# EAGLE design ShieldThunder (EAGLE 9.4.2)
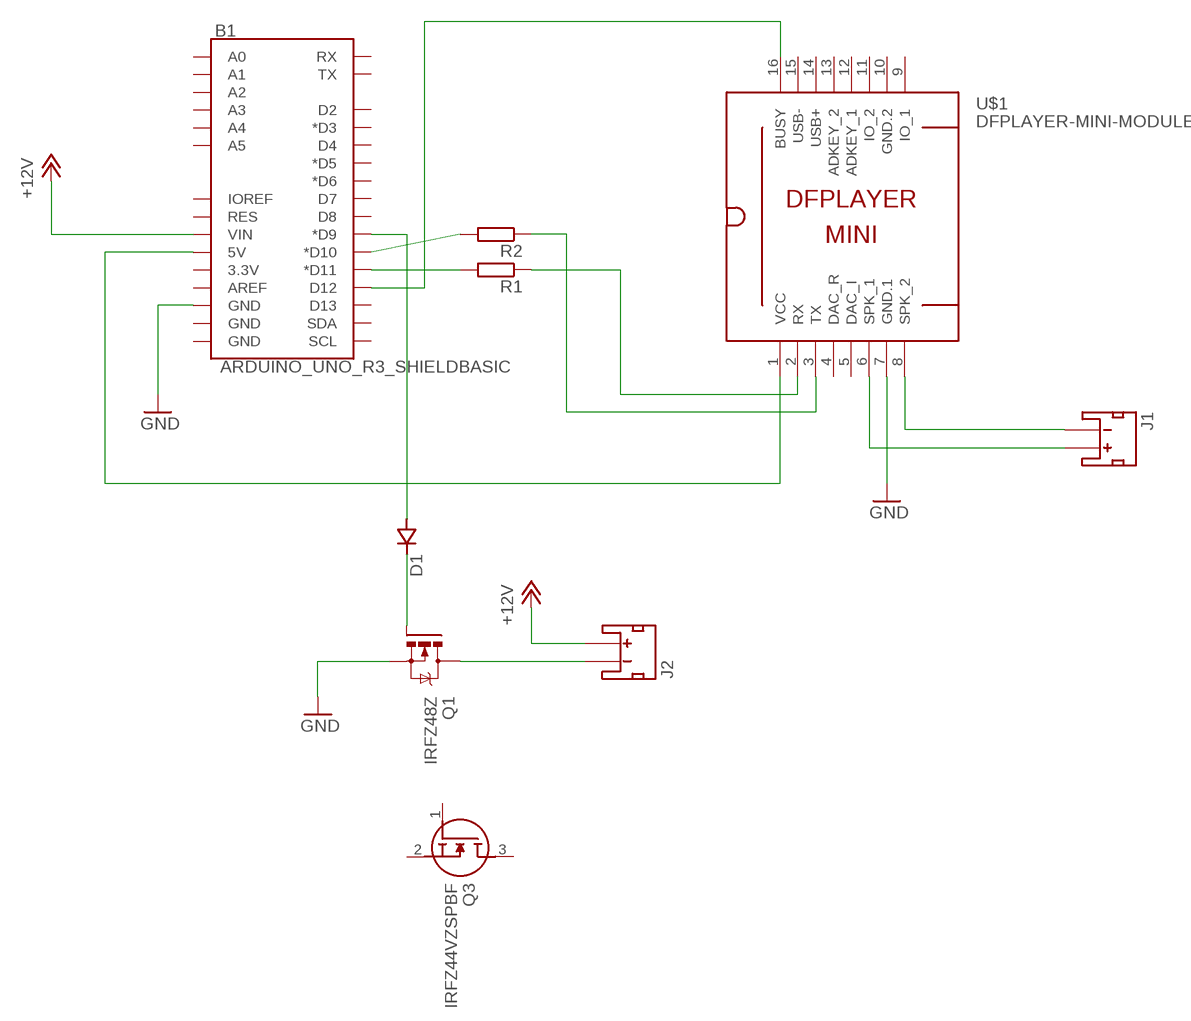
[diagram p0: schematic, sheet 1]

## Parts
B1  ARDUINO_UNO_R3_SHIELDBASIC  [UNO_R3_SHIELD]
D1  DSOT23  [SOT-23]
J1  JST_2MM_MALE  [JST-2-SMD]
J2  JST_2MM_MALE  [JST-2-SMD]
Q1  IRFZ48Z  [TO220BH]
Q3  IRFZ44VZSPBF  [D2PAK(TO-263AB)]
R1  R-EU_R0805  [R0805]
R2  R-EU_R0805  [R0805]
U$1  DFPLAYER-MINI-MODULE  [DFPLAYER-MINI-MODULE]

## Nets
+12V: B1.VIN J2.2(+)
GND: B1.GND@2(GND) Q1.S U$1.7(GND.1)
N$1: B1.D10(*D10) R2.2
N$2: B1.D11(*D11) R1.2
N$3: R1.1 U$1.2(RX)
N$4: R2.1 U$1.3(TX)
N$5: B1.D12 U$1.16(BUSY)
N$6: J1.2(+) U$1.6(SPK_1)
N$7: J1.1(-) U$1.8(SPK_2)
N$8: B1.D9(*D9) D1.3(A)
N$9: D1.1(C) Q1.G
N$10: J2.1(-) Q1.D
N$11: B1.5V U$1.1(VCC)
Unconnected: B1.3.3V B1.A0 B1.A1 B1.A2 B1.A3 B1.A4 B1.A5 B1.AREF B1.D2 B1.D3(*D3) B1.D4 B1.D5(*D5) B1.D6(*D6) B1.D7 B1.D8 B1.D13 B1.GND@0(GND) B1.GND@1(GND) B1.IOREF B1.RES B1.RX B1.SCL B1.SDA B1.TX J1.NC1(PAD1) J1.NC2(PAD2) J2.NC1(PAD1) J2.NC2(PAD2) Q3.1(G) Q3.2(S) Q3.3(D) U$1.4(DAC_R) U$1.5(DAC_I) U$1.9(IO_1) U$1.11(IO_2) U$1.12(ADKEY_1) U$1.13(ADKEY_2) U$1.14(USB+) U$1.15(USB-)

## Power pins joined to a net without a drawn wire
GND.2: U$1.10(GND.2)

## Library data of the parts
B1 = SparkFun-Boards:ARDUINO_UNO_R3_SHIELD: Arduino R3 Shield Footprint Shield form compatible with the Arduino Uno R3. SparkFun Products: MG2639 Cellular Shield <https://www.sparkfun.com/products/13120> MIDI Shield <https://www.sparkfun.com/products/12898> R3 Stackable Headers Kit <https://www.sparkfun.com/products/11417>
D1 = zetex:D: DIODE; MPN: CDSOT23-T03; OC_FARNELL: 1824866; OC_NEWARK: 75K7096
J1 J2 = SparkFun-Connectors:JST_2MM_MALE: JST 2MM MALE RA CONNECTOR Two pin, compact surface mount connector. Commonly used as a battery input connection point. We really like the solid locking feeling and high current rating on these small connectors. We use these all the time as battery connectors. Mates to single-cell LiPo batteries. Here is the connector we sell at SparkFun: JST Right Angle Connector - White <https://www.sparkfun.com/products/8612> (PRT-08612) Datasheet <http://www.sparkfun.com/datasheets/Prototyping/Connectors/JST-Horizontal.pdf> It was used on these SparkFun products: SparkFun MOSFET Power Controller <https://www.sparkfun.com/products/11214> (PRT-11214) SparkFun Battery Babysitter - LiPo Battery Manager <https://www.sparkfun.com/products/13777> (PRT-13777) And many, many others that required a lipo battery connection.; PROD_ID: CONN-11443; SF_ID: PRT-08612
Q1 = transistor-power:IRFZ48: N Channel HEXFET® Power MOSFET Logic Level Source: http://www.irf.com/product-info/datasheets/data/irfz48z.pdf
Q3 = SamacSys_Parts:IRFZ44VZSPBF: Infineon IRFZ44VZSPBF N-channel MOSFET, 57 A, 60 V HEXFET, 3-Pin D2PAK Source: Datasheet <https://componentsearchengine.com/Datasheets/1/IRFZ44VZSPBF.pdf>; DESCRIPTION: Infineon IRFZ44VZSPBF N-channel MOSFET, 57 A, 60 V HEXFET, 3-Pin D2PAK; HEIGHT: mm; MANUFACTURER_NAME: Infineon; MANUFACTURER_PART_NUMBER: IRFZ44VZSPBF; MOUSER_PART_NUMBER: 942-IRFZ44VZSPBF; MOUSER_PRICE-STOCK: https://www.mouser.com/Search/Refine.aspx?Keyword=942-IRFZ44VZSPBF
R1 R2 = rcl:R-EU_: RESISTOR, European symbol; SPICEPREFIX: 1K
U$1 = diy-modules:DFPLAYER-MINI-MODULE: DFPlayer Mini - MP3 player module based on YX5200 chip More details available here: https://www.dfrobot.com/wiki/index.php/DFPlayer_Mini_SKU:DFR0299 Click here to find device on ebay.com <http://www.ebay.com/sch/dfplayer+mini>

## Net classes
0 default: width 0.254 mm

## Board
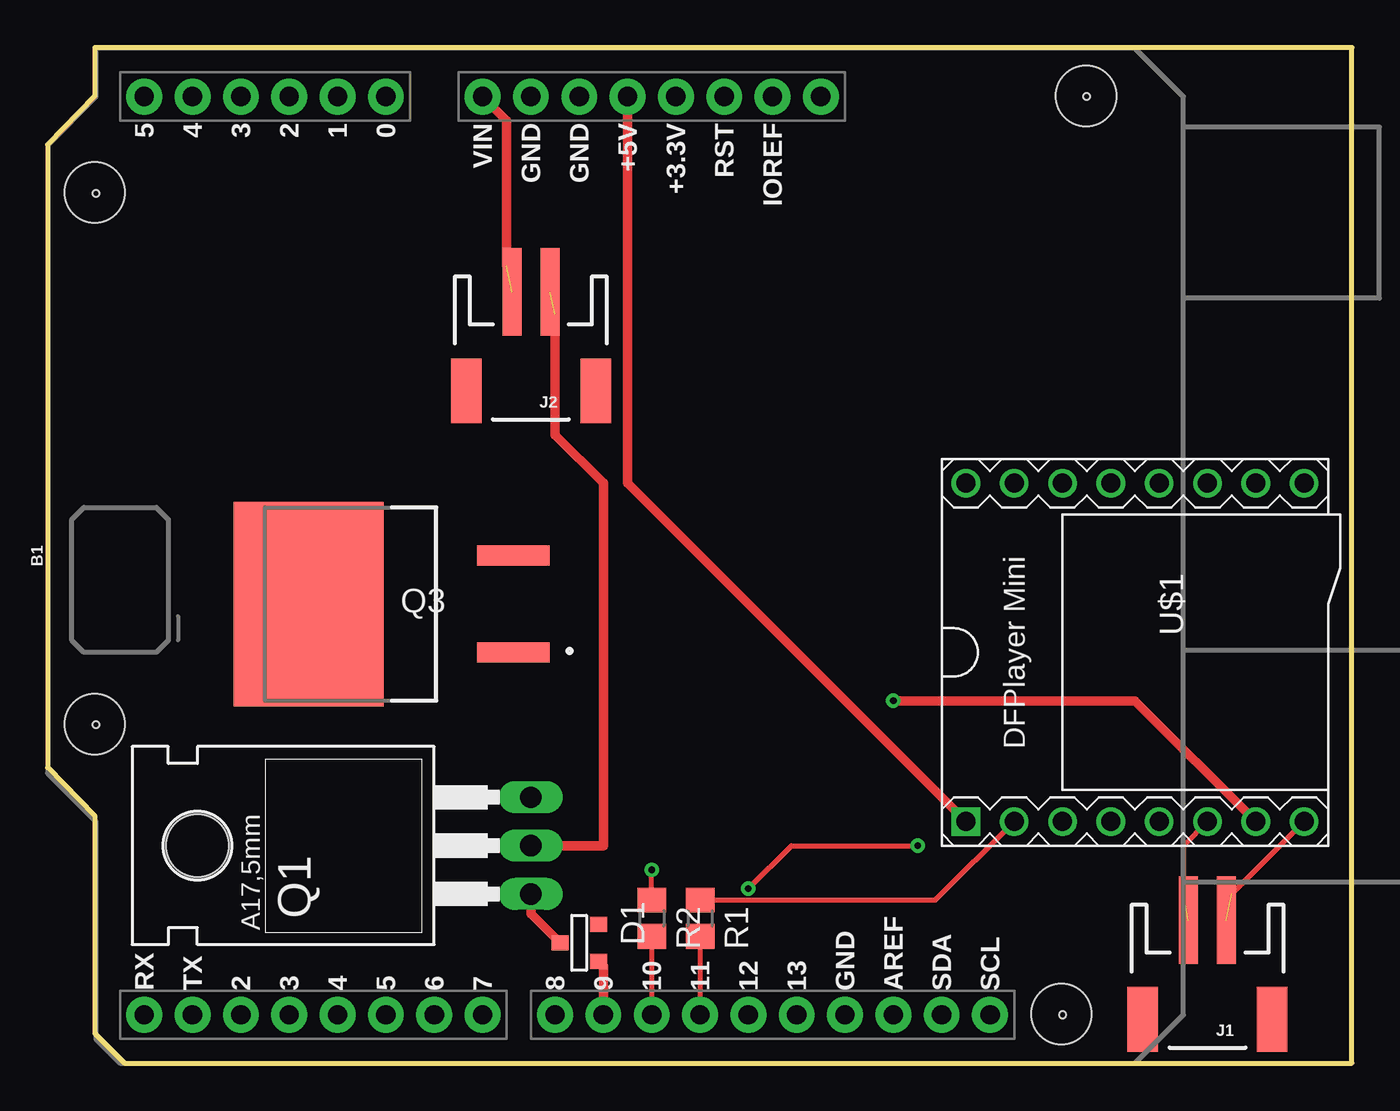
[diagram p1: board, top side]
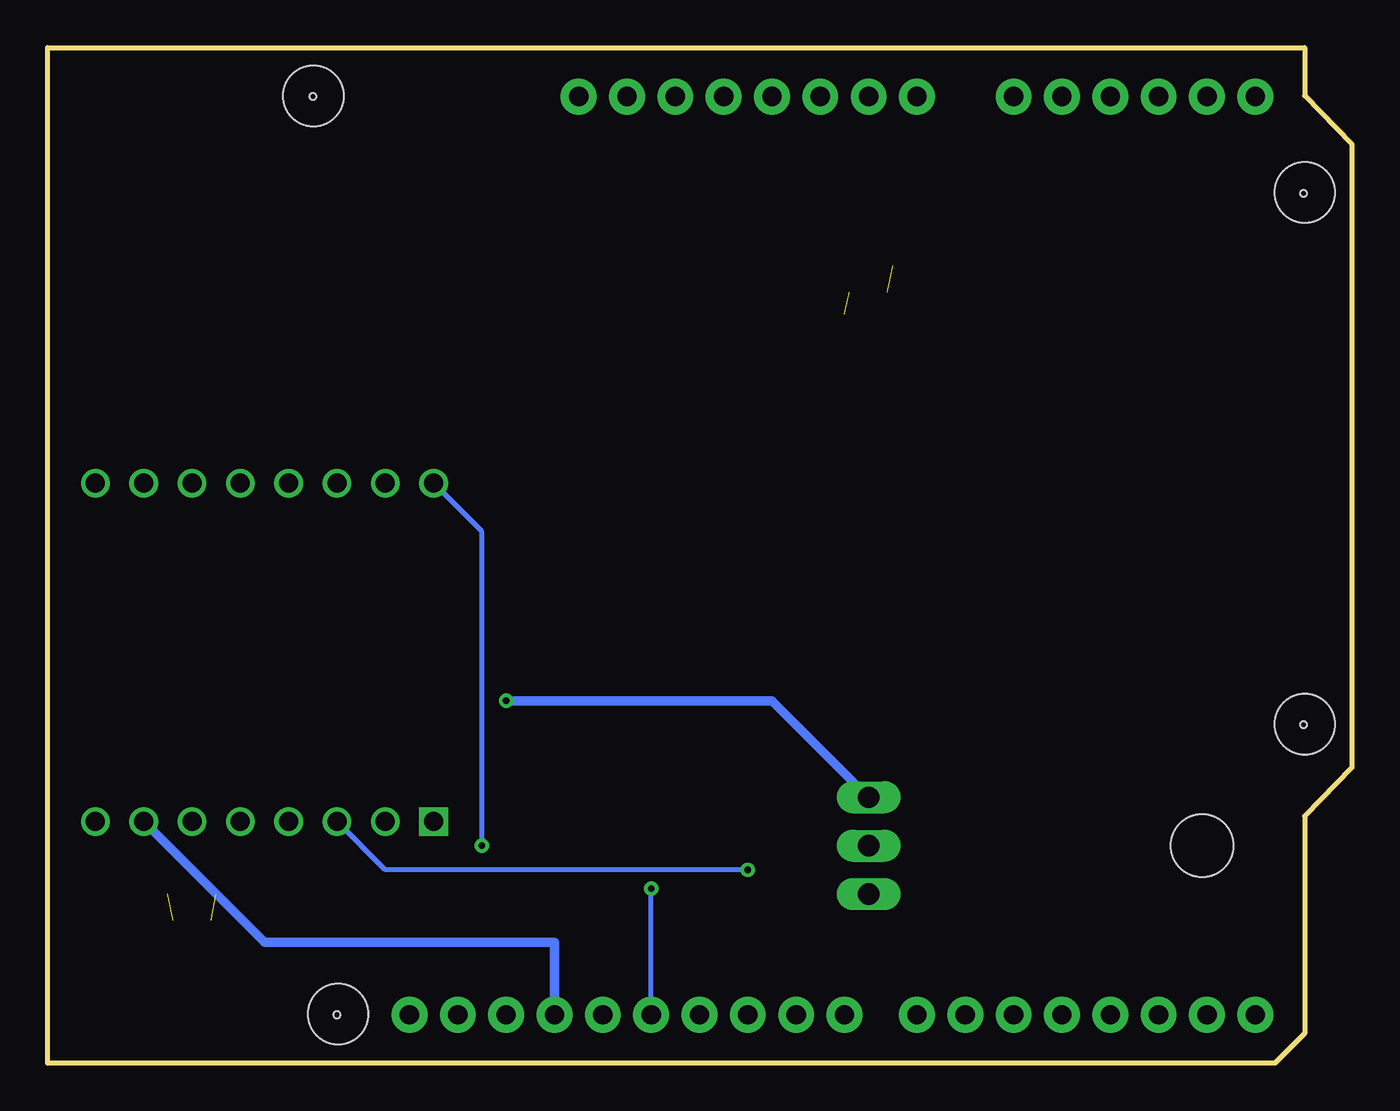
[diagram p2: board, bottom side, seen from below]

Size 68.55 x 53.38 mm. Coordinates in mm from the lower left corner, seen from the top.
Outline: 68.55,0 68.55,53.38 2.48,53.38 2.48,50.84 0,48.3 0,15.53 2.48,12.99 2.48,1.56 4.04,0 68.55,0
Copper layers (1*16): Top 0.035mm / dielectric 1.5mm / Bottom 0.035mm
Design rules "default": minimum track width 6mil, minimum drill 0.35mm, track to track 6mil, track to pad 6mil, pad to pad 6mil, via to via 6mil, smd to smd 6mil, copper to edge 40mil, drill to drill 6mil, minimum pad ring 10mil, minimum via ring 8mil, stop-mask expansion 4mil, vias tented up to drill 0mil, thermal gap 10mil
Holes 3.17 mm at 2.48,45.76 53.28,2.58 2.48,17.82 54.58,50.84
Holes 0.35 mm at 54.61,50.8 2.54,45.72 2.54,17.78 53.34,2.54

### Footprints (pad centres in the part's own frame; a part is rotated, then mirrored left to right if it is on the bottom)
UNO_R3_SHIELD = drill 1.016 pad 1.88: 3.3V 24.13,-2.54; 5V 24.13,0; A0 24.13,12.7; A1 24.13,15.24; A2 24.13,17.78; A3 24.13,20.32; A4 24.13,22.86; A5 24.13,25.4; AREF -24.13,-13.97; D2 -24.13,20.32; D3 -24.13,17.78; D4 -24.13,15.24; D5 -24.13,12.7; D6 -24.13,10.16; D7 -24.13,7.62; D8 -24.13,3.81; D9 -24.13,1.27; D10 -24.13,-1.27; D11 -24.13,-3.81; D12 -24.13,-6.35; D13 -24.13,-8.89; GND@0 24.13,2.54; GND@1 24.13,5.08; GND@2 -24.13,-11.43; IOREF 24.13,-7.62; NC 24.13,-10.16; RES 24.13,-5.08; RX -24.13,25.4; SCL -24.13,-19.05; SDA -24.13,-16.51; TX -24.13,22.86; VIN 24.13,7.62
SOT-23 = smd 0.787 x 0.889: 1 0.025,-1.016; 2 -0.94,1.016; 3 0.991,1.016
JST-2-SMD = smd 1 x 4.6: 1 -1,-3.7; 2 1,-3.7 | smd 1.6 x 3.4: NC1 -3.4,1.5; NC2 3.4,1.5
TO220BH = drill 1.118 long: D 0,-6.35; G -2.54,-6.35; S 2.54,-6.35 | hole 3.302: 0,11.176
D2PAK(TO-263AB) = smd 3.8 x 1.05: 1 -13.043,2.54; 2 -13.043,-2.54 | smd 7.9 x 10.75: 3 -2.293,0
R0805 = smd 1.3 x 1.5: 1 -0.95,0; 2 0.95,0
DFPLAYER-MINI-MODULE = drill 1 square: 1 -8.89,-8.89 | drill 1: 2 -6.35,-8.89; 3 -3.81,-8.89; 4 -1.27,-8.89; 5 1.27,-8.89; 6 3.81,-8.89; 7 6.35,-8.89; 8 8.89,-8.89; 9 8.89,8.89; 10 6.35,8.89; 11 3.81,8.89; 12 1.27,8.89; 13 -1.27,8.89; 14 -3.81,8.89; 15 -6.35,8.89; 16 -8.89,8.89

### Placement (x,y rotation side)
B1  30.48,26.67 90 top
D1  27.94,6.35 270 top
J1  60.96,3.81 180 top
J2  25.4,36.83 180 top
Q1  19.05,11.43 90 top
Q3  11.43,24.13 180 top
R1  34.29,7.62 270 top
R2  31.75,7.62 270 top
U$1  57.15,21.59 0 top

### Tracks (layer width: path | path; a pad name or v marks a point on that pad's centre or on a via)
+12V  (1 unrouted)
  Top 0.508: B1.VIN 24.13,49.53 24.13,41.91
GND  (via drill 0.35)
  Top 0.508: U$1.7 57.15,19.05 v44.45,19.05
  Bottom 0.508: U$1.7 57.15,6.35 41.91,6.35 B1.GND@2 | v44.45,19.05 30.48,19.05 Q1.S
N$1
  Top 0.254: R2.2 B1.D10
N$2
  Top 0.254: R1.2 B1.D11
N$3
  Top 0.254: R1.1 46.67,8.57 U$1.2
N$4  (via drill 0.35)
  Top 0.254: R2.1 v31.75,10.16
  Bottom 0.254: v31.75,10.16 50.8,10.16 U$1.3
N$5  (via drill 0.35)
  Top 0.254: v36.83,9.18 39.08,11.43 v45.72,11.43
  Bottom 0.254: B1.D12 v36.83,9.18 | v45.72,11.43 45.72,27.94 U$1.16
N$6  (1 unrouted)
  Top 0.254: U$1.6 59.69,11.43 59.69,8.89
N$7  (1 unrouted)
  Top 0.254: U$1.8 62.23,8.89
N$8
  Top 0.508: D1.3 29.21,5.11 B1.D9
N$9
  Top 0.508: D1.1 25.4,7.85 Q1.G
N$10  (1 unrouted)
  Top 0.508: Q1.D 29.21,11.43 29.21,30.48 26.67,33.02 26.67,39.37
N$11
  Top 0.508: U$1.1 30.48,30.48 B1.5V